# EasyEDA Pro project H桥.eprj, board 单相_TDSON-8
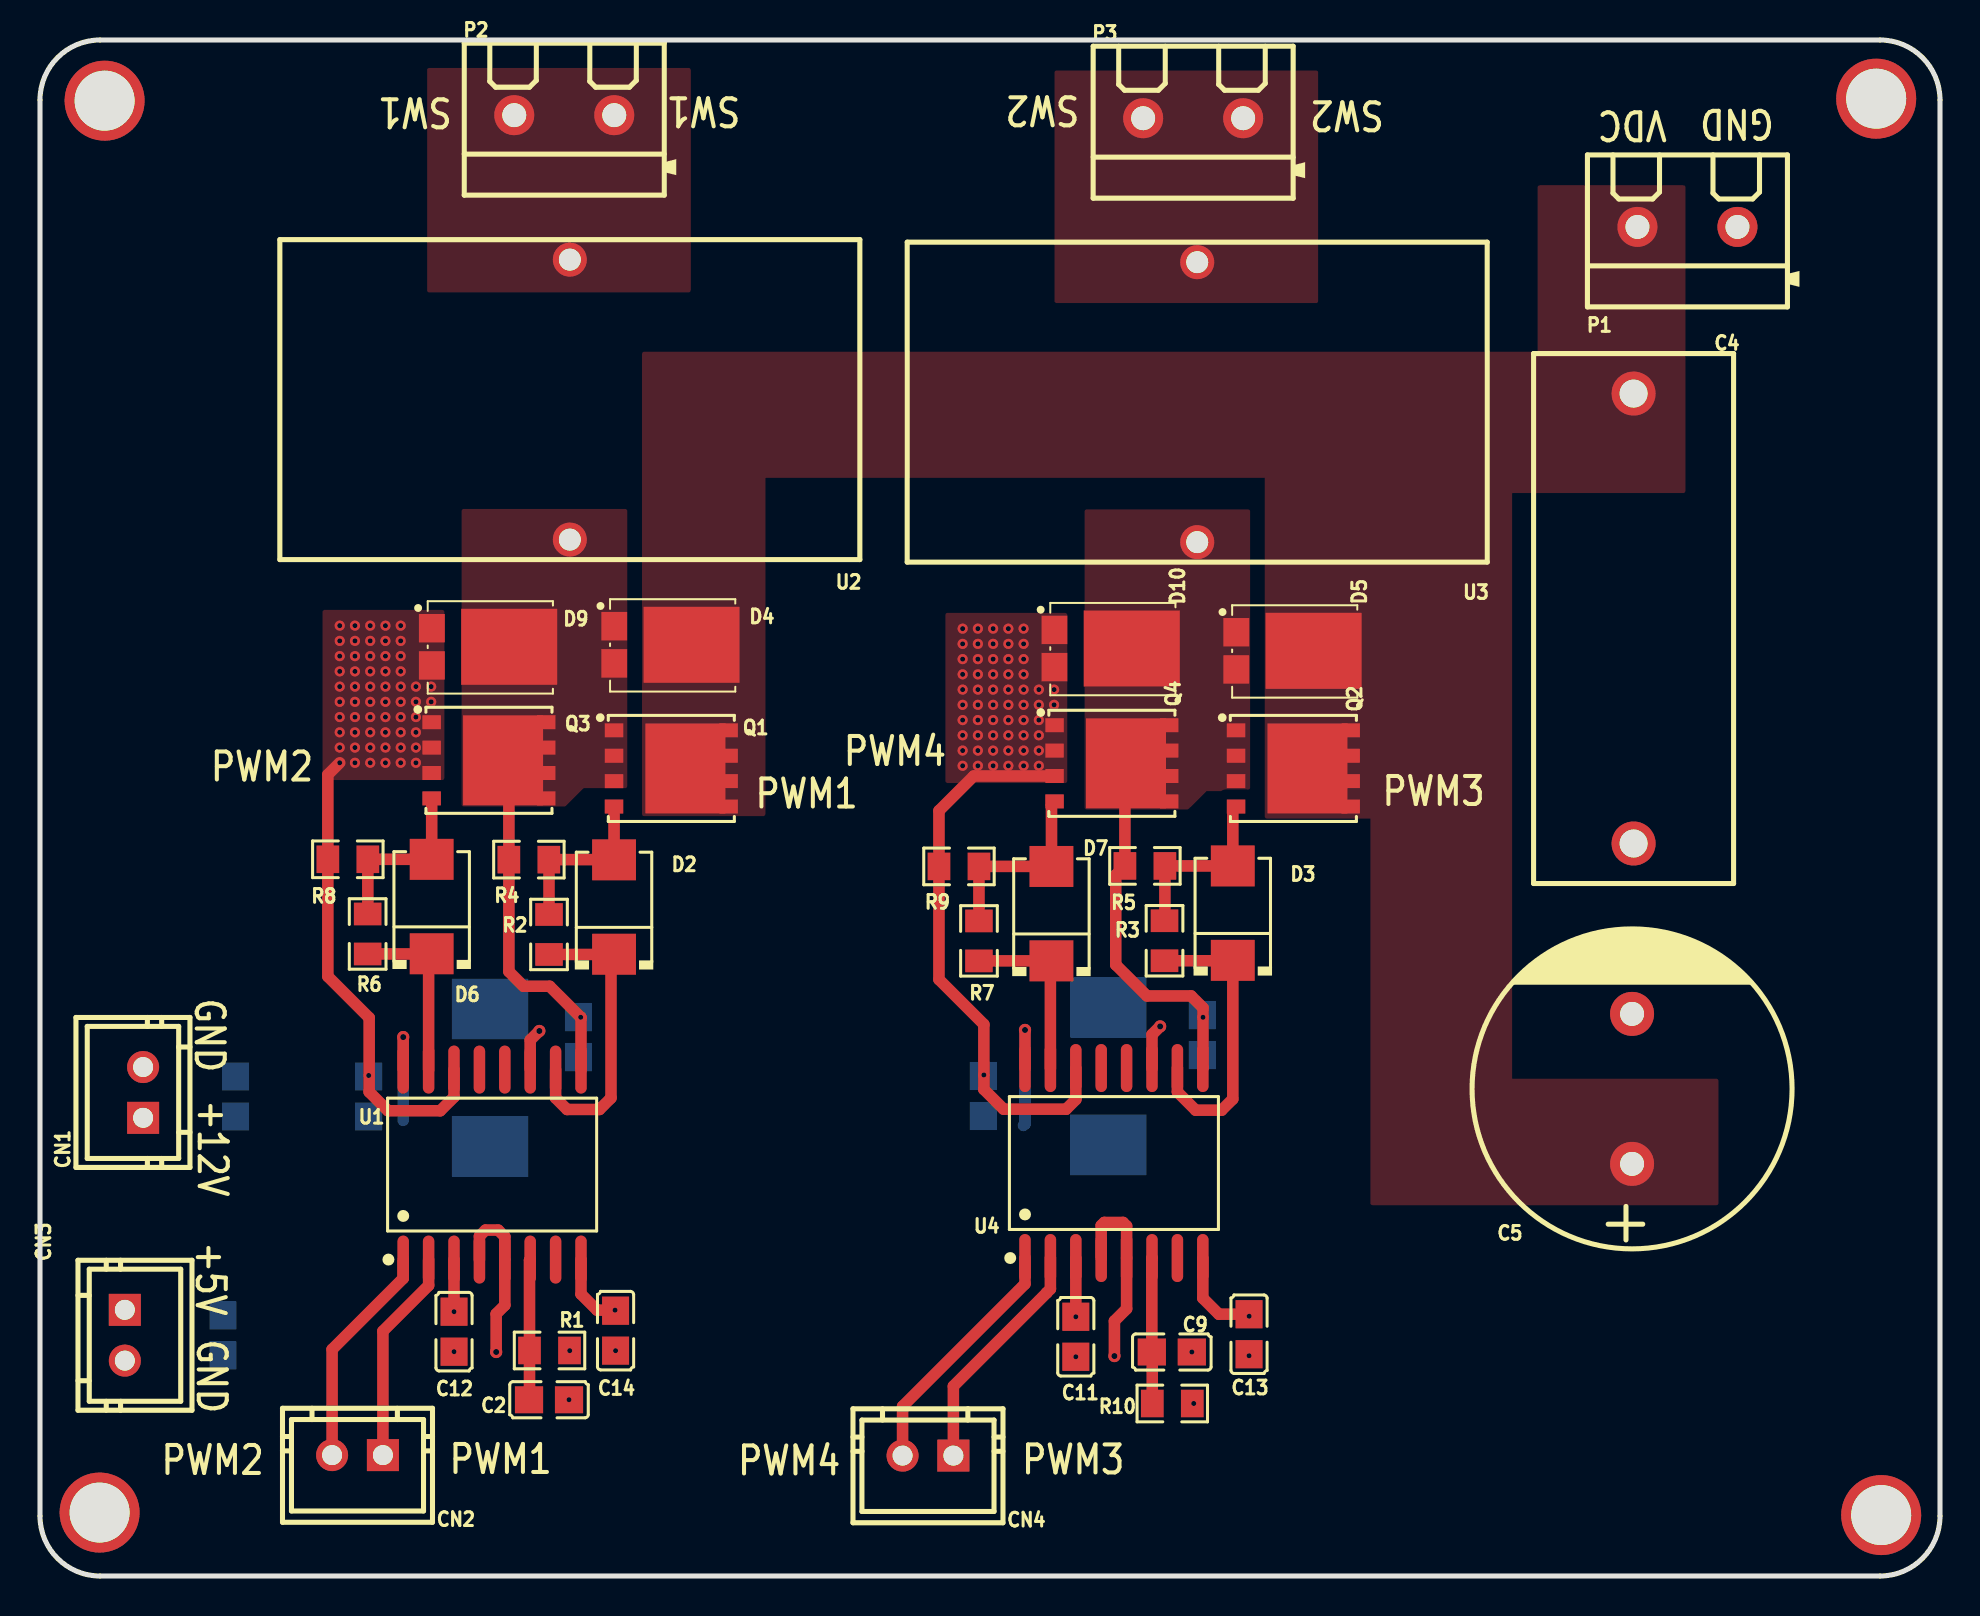
[diagram p7: board, top side]
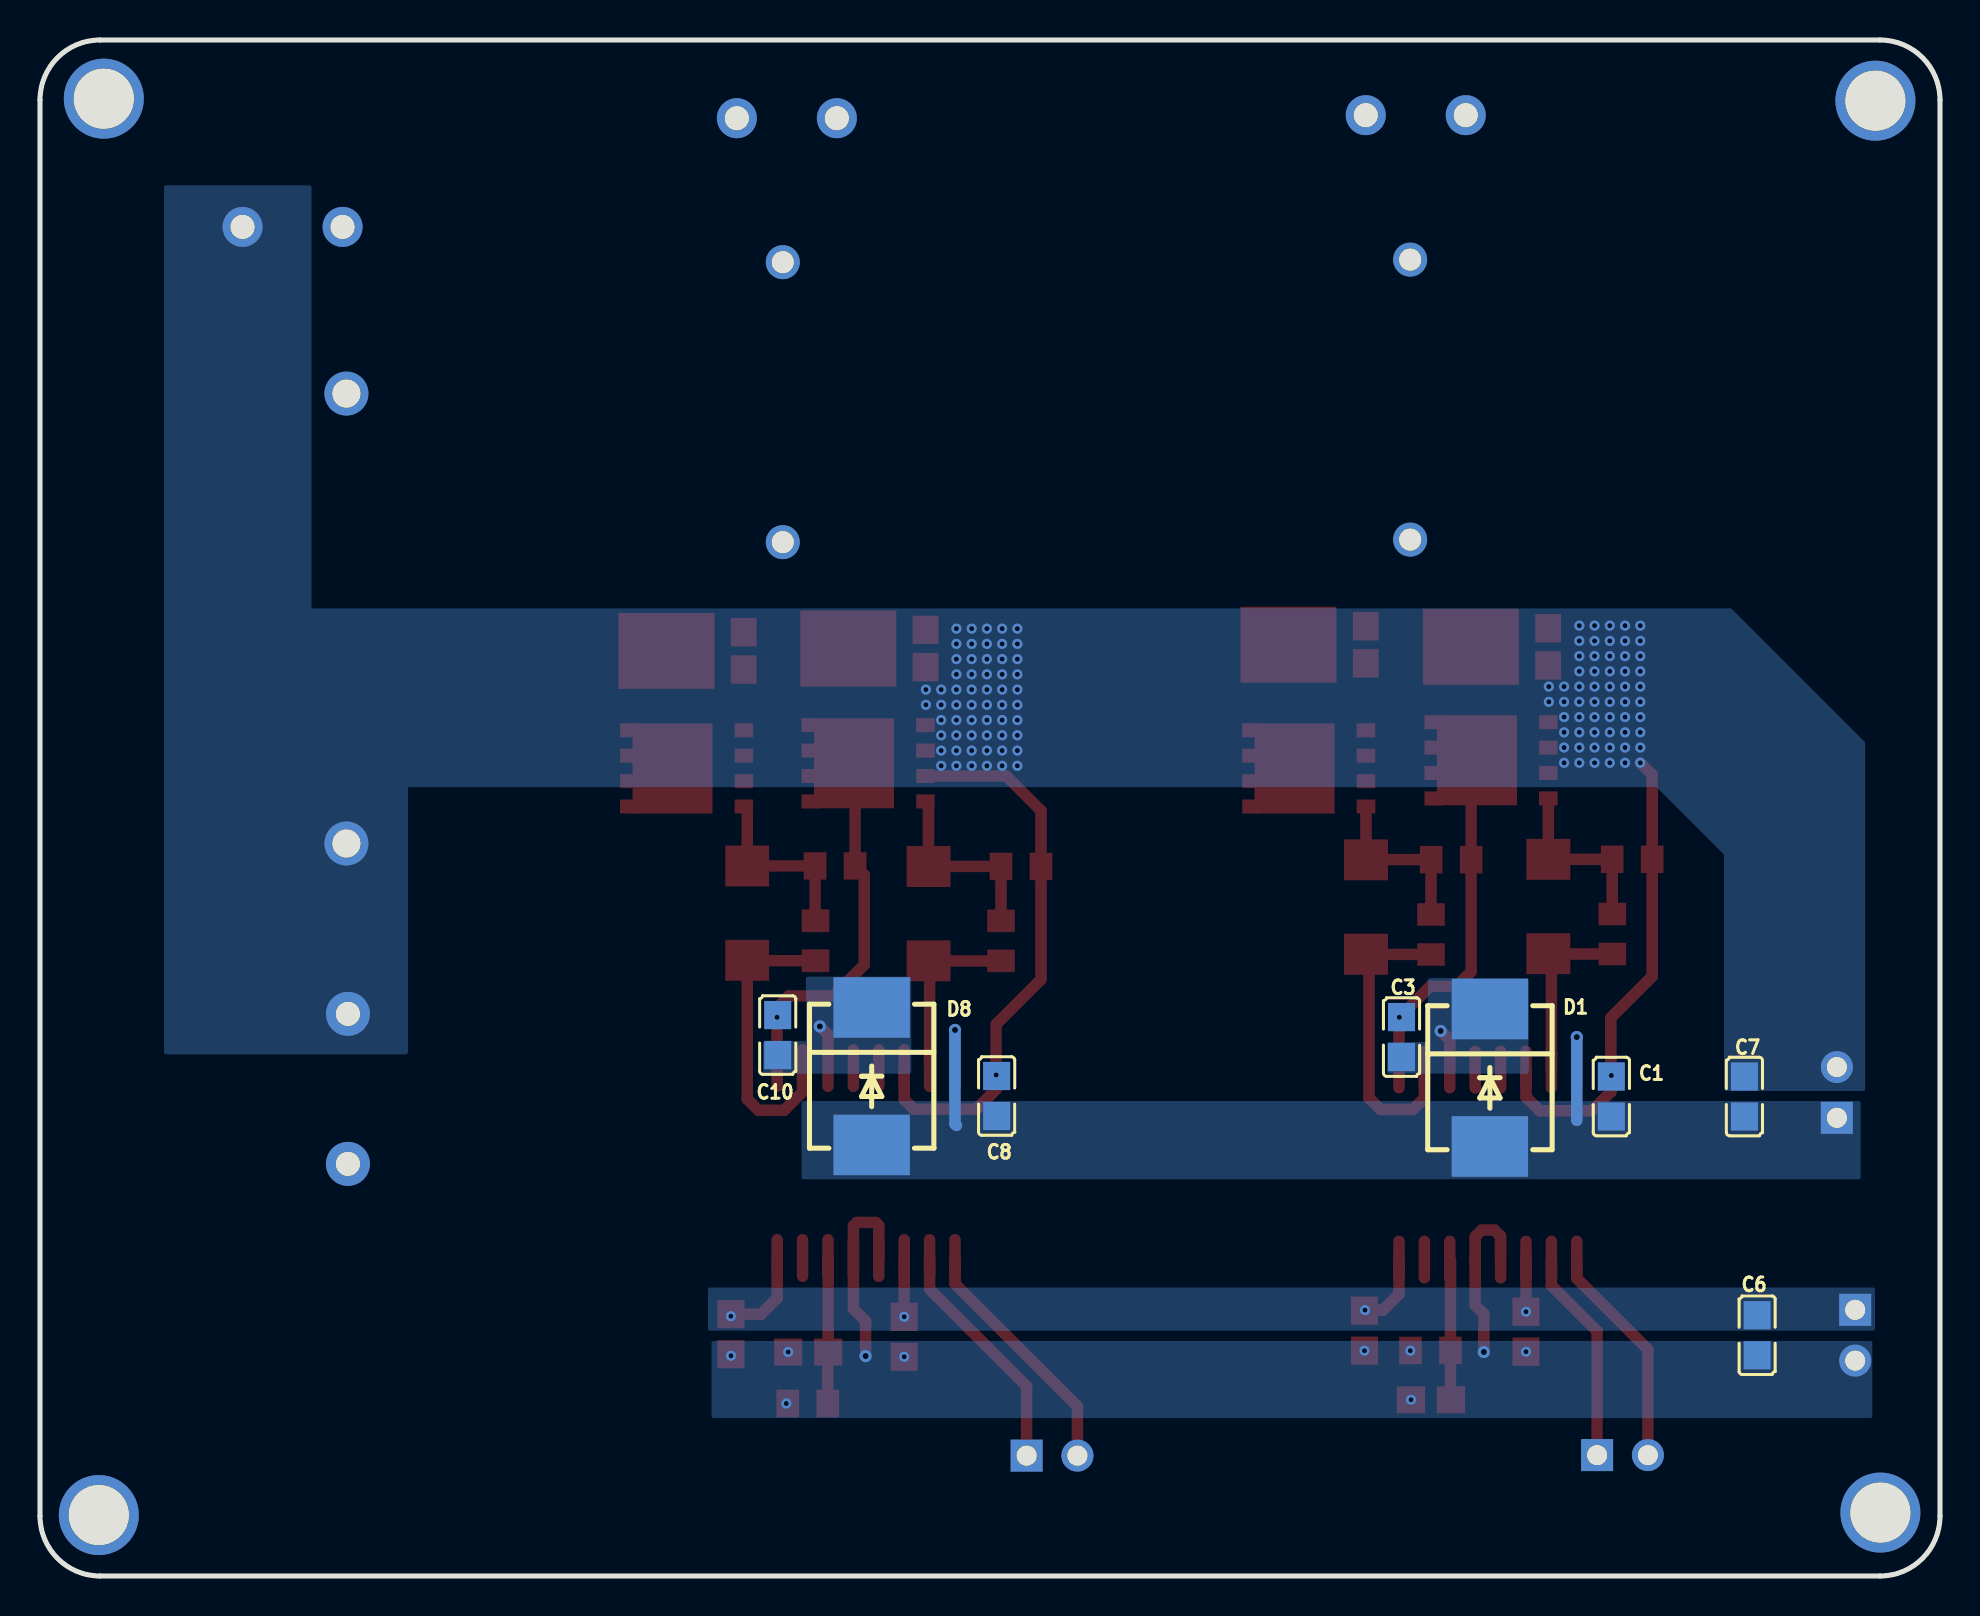
[diagram p8: board, bottom side, seen from below]

Outline 95 x 76.81 mm; copper layers: Top Layer, Bottom Layer. Coordinates in mm from the lower left corner of the outline.
Outline path: 0,73.81 0,3 arc(0.88,0.88) 3,0 92,0 arc(94.12,0.88) 95,3 95,73.81 arc(94.12,75.93) 92,76.81 3,76.81 arc(0.88,75.93) 0,73.81
Stack: Top Layer 0.035mm / Dielectric1 1.51mm FR4 er 4.5 / Bottom Layer 0.035mm

## Design rules (mm)
template: 自定义配置
spacing copperThickness1oz (default): track to track 0.508, other pairs 0.508 to 0.508
spacing copperThickness2oz: track to track 0.203, other pairs 0.152 to 0.3
track width copperThickness1oz (default): min 0.127, default 0.254, max 2.54
track width copperThickness2oz: min 0.203, default 0.254, max 2.54
differential pair differentialPair (default): width min 0.127, default 0.254, max 2.54; gap min 0.152, default 0.152
via viaSize (default): diameter min 0.5, default 0.508, max 10; hole min 0.127, default 0.254, max 6.3

## Placement (name value [footprint] x y rotation side)
C1  1uF  [C0805]  16.43 23.98 270 bottom
C2  100nF  [C0805]  25.45 8.81 180 top
C3  1uF  [C0805]  26.92 26.95 270 bottom
C4  1uF  [CAP-TH_L26.5-W10.0-P22.50-D1.4]  79.68 47.88 270 top
C5  470uF  [CAP-TH_BD16.0-P7.50-D1.2-FD]  79.6 24.36 90 top
C6  100nF  [C0805]  9.14 12.04 90 bottom
C7  100nF  [C0805]  9.78 23.98 270 bottom
C8  1uF  [C0805]  47.17 24 270 bottom
C9  100nF  [C0805]  56.59 11.2 180 top
C10  1uF  [C0805]  58.12 27.05 270 bottom
C11  100nF  [C0805]  51.79 11.96 90 top
C12  100nF  [C0805]  20.7 12.22 90 top
C13  100nF  [C0805]  60.45 12.09 90 top
C14  100nF  [C0805]  28.78 12.27 90 top
CN1  CON2-2.54*2P  [CONN-TH_2P-P2.54-V]  5.16 24.18 90 top
CN2  CON2-2.54*2P  [CONN-TH_2P-P2.54-V]  15.88 6.05 180 top
CN3  CON2-2.54*2P  [CONN-TH_2P-P2.54-V]  4.24 12.04 270 top
CN4  CON2-2.54*2P  [CONN-TH_2P-P2.54-V]  44.4 6.02 180 top
D1  RS3MC  [SMC_L7.1-W6.2-LS8.1-R-RD]  22.5 24.92 270 bottom
D2  SS34BG  [SMB_L4.6-W3.6-LS5.3-RD]  28.7 33.45 90 top
D3  SS34BG  [SMB_L4.6-W3.6-LS5.3-RD]  59.64 33.15 90 top
D4  ST20100L  [TO-277_3P-L5.7-W4.2-LS6.5-BR]  30.64 46.57 180 top
D5  ST20100L  [TO-277_3P-L5.7-W4.2-LS6.5-BR]  61.75 46.26 180 top
D6  SS34BG  [SMB_L4.6-W3.6-LS5.3-RD]  19.58 33.48 90 top
D7  SS34BG  [SMB_L4.6-W3.6-LS5.3-RD]  50.57 33.12 90 top
D8  RS3MC  [SMC_L7.1-W6.2-LS8.1-R-RD]  53.42 24.99 270 bottom
D9  ST20100L  [TO-277_3P-L5.7-W4.2-LS6.5-BR]  21.53 46.47 180 top
D10  ST20100L  [TO-277_3P-L5.7-W4.2-LS6.5-BR]  52.65 46.38 180 top
NOREF  -  [Pad_e50]  2.98 3.17 0 top
NOREF#2  -  [Pad_e51]  92.06 3.05 0 top
NOREF#3  -  [Pad_e52]  91.81 73.88 0 top
NOREF#4  -  [Pad_e48]  3.23 73.78 0 top
P1  KF301-2P接线端子  [CONN-TH_XY301V-A-5.0-2P]  82.37 67.46 0 top
P2  KF301-2P接线端子  [CONN-TH_XY301V-A-5.0-2P]  26.21 73.05 0 top
P3  KF301-2P接线端子  [CONN-TH_XY301V-A-5.0-2P]  57.66 72.9 0 top
Q1  BSC0805LS  [PG-TDSON-8_L5.2-W5.9-P1.27-LS6.2-BL-EP]  31.57 40.38 270 top
Q2  BSC0805LS  [PG-TDSON-8_L5.2-W5.9-P1.27-LS6.2-BL-EP]  62.67 40.38 270 top
Q3  BSC0805LS  [PG-TDSON-8_L5.2-W5.9-P1.27-LS6.2-BL-EP]  22.45 40.79 270 top
Q4  BSC0805LS  [PG-TDSON-8_L5.2-W5.9-P1.27-LS6.2-BL-EP]  53.59 40.64 270 top
R1  20kΩ  [R0805]  25.48 11.28 180 top
R2  2Ω  [R0805]  25.45 32.08 90 top
R3  2Ω  [R0805]  56.23 31.77 90 top
R4  10kΩ  [R0805]  24.44 35.82 0 top
R5  10kΩ  [R0805]  55.25 35.51 0 top
R6  2Ω  [R0805]  16.38 32.11 90 top
R7  2Ω  [R0805]  46.95 31.76 90 top
R8  10kΩ  [R0805]  15.39 35.84 0 top
R9  10kΩ  [R0805]  45.95 35.48 0 top
R10  20kΩ  [R0805]  56.61 8.63 180 top
U1  UCC21520  [SOIC-16_L10.3-W7.5-P1.27-LS10.3-BL]  22.61 20.57 0 top
U2  860uH  [IND-TH_L29.0-W16.0-P14.00-D0.8]  26.49 58.83 180 top
U3  860uH  [IND-TH_L29.0-W16.0-P14.00-D0.8]  57.86 58.7 180 top
U4  UCC21520  [SOIC-16_L10.3-W7.5-P1.27-LS10.3-BL]  53.7 20.65 0 top

## Footprints (pads in the part's own frame, mm; a bottom-side part is the same pattern mirrored in y, then rotated)
C0805
  rect 1.41x1.35 smd: 1(-1,0) 2(1,0)
CAP-TH_BD16.0-P7.50-D1.2-FD
  round 2.2 hole 1.2: 1(-3.75,0) 2(3.75,0)
CAP-TH_L26.5-W10.0-P22.50-D1.4
  round 2.2 hole 1.4: 1(-11.249,0) 2(11.249,0)
CONN-TH_2P-P2.54-V
  rect 1.6x1.6 hole 1: 1(-1.27,0)
  round 1.6 hole 1: 2(1.27,0)
CONN-TH_XY301V-A-5.0-2P
  round 2 hole 1.2: 1(-2.5,0) 2(2.5,0)
IND-TH_L29.0-W16.0-P14.00-D0.8
  round 1.7 hole 1.1: 1(0,7) 2(0,-7)
Pad_e48
  round 4 hole 3: 1(0,0)
Pad_e50
  round 4 hole 3: 1(0,0)
Pad_e51
  round 4 hole 3: 1(0,0)
Pad_e52
  round 4 hole 3: 1(0,0)
PG-TDSON-8_L5.2-W5.9-P1.27-LS6.2-BL-EP
  rect 0.7x0.925 smd: 1(-1.905,-2.865) 2(-0.635,-2.865) 3(0.635,-2.865) 4(1.905,-2.865) 5(1.905,2.865) 6(0.635,2.865) 7(-0.635,2.865) 8(-1.905,2.865)
  rect 4.5x4 smd: 9(0.001,0.705)
R0805
  rect 1.133x1.377 smd: 1(-1,0) 2(1,0)
SMB_L4.6-W3.6-LS5.3-RD
  rect 2.047x2.192 smd: 1(-2.361,0) 2(2.361,0)
SMC_L7.1-W6.2-LS8.1-R-RD
  rect 3.03x3.82 smd: 1(3.435,0) 2(-3.435,0)
SOIC-16_L10.3-W7.5-P1.27-LS10.3-BL
  oval 0.574x2.401 smd: 1(-4.445,-4.75) 2(-3.175,-4.75) 3(-1.905,-4.75) 4(-0.635,-4.75) 5(0.635,-4.75) 6(1.905,-4.75) 7(3.175,-4.75) 8(4.445,-4.75) 9(4.445,4.75) 10(3.175,4.75) 11(1.905,4.75) 12(0.635,4.75) 13(-0.635,4.75) 14(-1.905,4.75) 15(-3.175,4.75) 16(-4.445,4.75)
TO-277_3P-L5.7-W4.2-LS6.5-BR
  rect 1.29x1.423 smd: 1(1.933,-0.93) 3(1.933,0.93)
  rect 4.8x3.8 smd: 2(-1.933,0)

## Nets
As in the schematic.

Pads without a net: NOREF 1; NOREF#2 1; NOREF#3 1; NOREF#4 1; U1 7 12 13; U4 7 12 13

## Via types
v1: diameter 0.508, hole 0.254, Top Layer to Bottom Layer, 132 vias
v2: diameter 0.61, hole 0.305, Top Layer to Bottom Layer, 6 vias

## Routing (per net, layer and track width the routed paths; a pad name or vN(x,y) marks a point on that pad's centre or on a via; arc(x,y) is an arc through that point)
+5V: length 14
  Top Layer w0.574: U4.8 58.14,13.89 58.94,13.09 C13.2 ; U1.8 27.05,14.1 27.85,13.3 v1(28.75,13.3) ; v1(20.7,13.22) U1.3 ; v1(51.79,12.96) U4.3
  vias: v1(60.46,12.99)
+12V: length 12.5
  Top Layer w0.574: U1.16 v2(18.16,26.95) ; 49.25,25.4 v2(49.25,27.31)
  Bottom Layer w0.574: v2(18.16,26.95) 18.16,22.78 ; 49.17,22.53 49.25,22.61 v2(49.25,27.31)
DGND: length 18.4
  Top Layer w0.574: v2(53.72,11) 53.72,12.75 54.33,13.36 U4.5 54.33,17.5 54.15,17.68 53.21,17.68 53.06,17.53 U4.4 ; U1.4 21.97,16.99 22.28,17.3 22.91,17.3 23.24,16.97 U1.5 23.24,13.54 22.81,13.11 v2(22.81,11.2) ; v1(26.49,11.27) R1.1
  vias: v1(20.7,11.22) v1(26.45,8.81) v1(28.78,11.27) v1(51.79,10.96) v1(57.59,11.2) v1(57.69,8.63) v1(60.45,11.01)
PGND: length 52
  Top Layer w0.574: v1(14.99,40.67) 14.39,40.07 R8.1 14.39,29.98 16.46,27.91 16.46,24.21 17.4,23.27 20.02,23.27 20.7,23.95 U1.14 ; Q4.3 46.69,40 44.95,38.27 R9.1 44.95,29.83 47.19,27.58 v1(47.19,25.06) 47.19,24.33 48.18,23.34 51.31,23.34 51.79,23.83 51.79,25.4
  vias: v1(14.99,47.52) v1(14.99,46.76) v1(14.99,46) v1(14.99,45.24) v1(14.99,44.48) v1(14.99,43.71) v1(14.99,42.95) v1(14.99,42.19) v1(14.99,41.43) v1(15.75,47.52) v1(15.75,46.76) v1(15.75,46) v1(15.75,45.24) v1(15.75,44.48) v1(15.75,43.71) v1(15.75,42.95) v1(15.75,42.19) v1(15.75,41.43) v1(15.75,40.67) v1(16.43,25.03) v1(16.51,47.52) v1(16.51,46.76) v1(16.51,46) v1(16.51,45.24) v1(16.51,44.48) v1(16.51,43.71) v1(16.51,42.95) v1(16.51,42.19) v1(16.51,41.43) v1(16.51,40.67) v1(17.27,47.52) v1(17.27,46.76) v1(17.27,46) v1(17.27,45.24) v1(17.27,44.48) v1(17.27,43.71) v1(17.27,42.95) v1(17.27,42.19) v1(17.27,41.43) v1(17.27,40.67) v1(18.03,47.52) v1(18.03,46.76) v1(18.03,46) v1(18.03,45.24) v1(18.03,44.48) v1(18.03,43.71) v1(18.03,42.95) v1(18.03,42.19) v1(18.03,41.43) v1(18.03,40.67) v1(18.8,44.48) v1(18.8,43.71) v1(18.8,42.95) v1(18.8,42.19) v1(18.8,41.43) v1(18.8,40.67) v1(19.56,44.48) v1(19.56,43.71) v1(46.13,47.37) v1(46.13,46.61) v1(46.13,45.85) v1(46.13,45.09) v1(46.13,44.33) v1(46.13,43.56) v1(46.13,42.8) v1(46.13,42.04) v1(46.13,41.28) v1(46.13,40.52) v1(46.89,47.37) v1(46.89,46.61) v1(46.89,45.85) v1(46.89,45.09) v1(46.89,44.33) v1(46.89,43.56) v1(46.89,42.8) v1(46.89,42.04) v1(46.89,41.28) v1(46.89,40.52) v1(47.66,47.37) v1(47.66,46.61) v1(47.66,45.85) v1(47.66,45.09) v1(47.66,44.33) v1(47.66,43.56) v1(47.66,42.8) v1(47.66,42.04) v1(47.66,41.28) v1(47.66,40.52) v1(48.42,47.37) v1(48.42,46.61) v1(48.42,45.85) v1(48.42,45.09) v1(48.42,44.33) v1(48.42,43.56) v1(48.42,42.8) v1(48.42,42.04) v1(48.42,41.28) v1(48.42,40.52) v1(49.18,47.37) v1(49.18,46.61) v1(49.18,45.85) v1(49.18,45.09) v1(49.18,44.33) v1(49.18,43.56) v1(49.18,42.8) v1(49.18,42.04) v1(49.18,41.28) v1(49.18,40.52) v1(49.94,44.33) v1(49.94,43.56) v1(49.94,42.8) v1(49.94,42.04) v1(49.94,41.28) v1(49.94,40.52) v1(50.7,44.33) v1(50.7,43.56)
H1: length 15.2
  Top Layer w0.574: U1.10 25.78,23.9 26.35,23.33 27.98,23.33 28.55,23.9 28.55,30.94 28.69,31.08 ; 28.69,31.08 D2.1 ; 28.69,31.08 R2.1
H2: length 14.9
  Top Layer w0.574: 56.87,25.4 56.87,24.21 57.78,23.29 59.08,23.29 59.64,23.85 D3.1 59.62,30.77 R3.1
L1: length 9
  Top Layer w0.574: 19.43,30.96 19.58,31.12 ; 19.43,30.96 19.29,31.11 R6.1 ; 19.43,30.96 U1.15
L2: length 9
  Top Layer w0.574: 50.52,25.4 50.52,30.71 50.57,30.76 R7.1
PWM1: length 10.7
  Top Layer w0.574: U1.2 19.43,14.53 17.14,12.24 CN2.1
PWM2: length 11.3
  Top Layer w0.574: U1.1 18.16,14.88 14.61,11.33 CN2.2
PWM3: length 11.9
  Top Layer w0.574: CN4.1 45.67,9.49 50.33,14.16 50.33,14.16 50.52,14.35 U4.2
PWM4: length 12.4
  Top Layer w0.574: CN4.2 43.13,8.48 49.25,14.61 U4.1
VS1: length 17.8
  Top Layer w0.574: Q3.9 23.44,40.5 R4.1 23.44,30.23 24.18,29.49 25.49,29.49 v1(27.03,27.94) 27.05,27.92 U1.9
VS2: length 18.6
  Top Layer w0.574: Q4.9 54.25,40.59 R5.1 53.79,35.05 53.79,30.57 55.35,29.01 57.56,29.01 58.15,28.41 v1(58.15,27.94) 58.15,25.41 58.14,25.4
$1N2033: length 9
  Top Layer w0.574: 19.58,38.88 D6.2 ; 19.58,35.84 R8.2 16.39,33.11 R6.2
$1N2035: length 8.7
  Top Layer w0.574: 28.7,38.48 D2.2 28.69,35.82 R4.2 25.45,35.82 R2.2
$1N2037: length 9.2
  Top Layer w0.574: D3.2 59.64,38.31 Q2.4 ; 59.64,35.51 R5.2 56.25,32.78 R3.2
$1N2039: length 9.7
  Top Layer w0.574: R7.2 R9.2 50.57,35.48 50.58,35.49 50.58,38.58 Q4.4
$1N2046: length 7.3
  Top Layer w0.574: U4.6 55.59,15.89 C9.2 55.61,11.18 R10.2
$1N2049: length 2.1
  Top Layer w0.574: U1.11 24.51,26.8 v2(24.97,27.25)
$1N2054: length 7
  Top Layer w0.574: C2.2 24.48,8.84 R1.2 24.48,15.79 U1.6
$1N4233: length 2.3
  Top Layer w0.574: 55.6,25.4 55.6,27.08 v2(56.01,27.48)

## Copper pours and planes (outline as drawn; the poured copper is in the pictures)
+5V on Bottom Layer: 3.25,14.43 61.6,14.43 61.6,12.27 3.25,12.27
+12V on Bottom Layer: 3.99,23.75 56.9,23.75 56.92,23.72 56.92,19.84 3.96,19.84 3.96,23.72
+VIN on Top Layer: 74.88,69.55 74.88,61.21 30.1,61.21 30.1,38 36.27,38 36.27,54.92 61.24,54.92 61.24,37.87 66.52,37.87 66.52,18.57 66.55,18.54 83.9,18.54 83.92,18.57 83.92,24.87 73.61,24.87 73.61,54.15 82.27,54.15 82.27,69.55
DGND on Bottom Layer: 3.38,11.84 61.42,11.84 61.42,7.9 3.38,7.9
PGND on Top Layer: 45.27,48.16 51.36,48.16 51.36,39.65 45.27,39.65
PGND on Top Layer: 14.12,48.31 20.22,48.31 20.22,39.8 14.12,39.8
PGND on Bottom Layer: 10.44,48.39 81.43,48.39 81.43,69.55 88.8,69.55 88.8,26.09 76.61,26.09 76.61,39.45 14.17,39.45 10.8,36.07 10.8,24.23 3.74,24.23 3.74,41.69
BRIDGE1 on Top Layer: 19.35,75.41 32.54,75.41 32.54,64.19 19.35,64.19
BRIDGE2 on Top Layer: 50.72,75.29 63.91,75.29 63.91,63.65 50.72,63.65
VS1 on Top Layer: 21.08,38.48 26.26,38.48 27.18,39.4 29.36,39.4 29.36,53.36 21.08,53.36
VS2 on Top Layer: 52.23,38.33 57.41,38.33 58.33,39.25 60.51,39.25 60.51,53.34 52.23,53.34
$1N2049 on Bottom Layer: 20.57,29.9 25.61,29.9 25.61,26.71 27.65,26.71 27.65,25.12 20.57,25.12
$1N4233 on Bottom Layer: 51.44,29.97 56.7,29.97 56.7,26.76 58.84,26.76 58.84,25.12 51.44,25.12

## Text on the board
Top Silkscreen Layer: PWM2 | PWM1 | PWM4 | PWM3 | SW1 | SW2 | VDC | GND | +5V | +12V
